# Altium schematic sheet sb-sonata-led.SchDoc: LEDs and Switches
size Letter; Organization: NewAE Technology Inc.; Address1: 1083 Queen St., Suite 196; Address2: Halifax; Address3: NS; Address4: Canada B3H 0B2; SheetNumber: 8; SheetTotal: 22; SheetApproved: YES
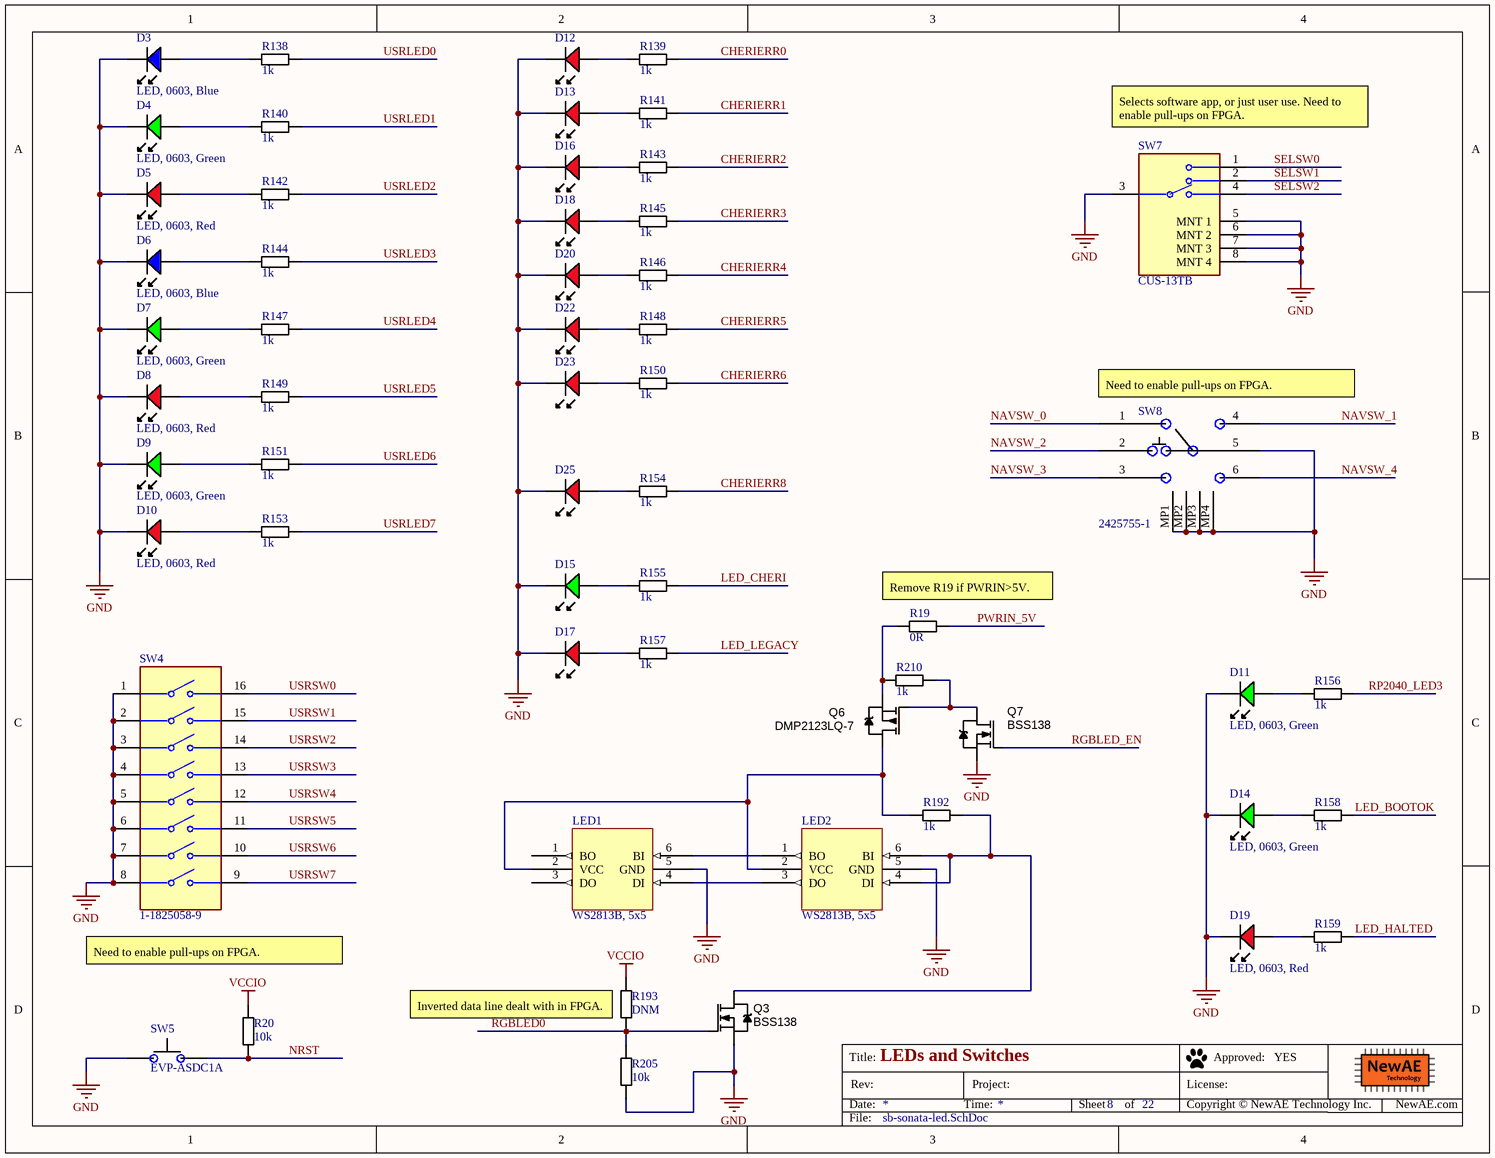
[diagram p0: sb-sonata-led.SchDoc]

## Parts
D3  LED, 0603, Blue  [LED-0603-BLUE]
D4  LED, 0603, Green  [LED-0603-GREEN]
D5  LED, 0603, Red  [LED-0603-RED]
D6  LED, 0603, Blue  [LED-0603-BLUE]
D7  LED, 0603, Green  [LED-0603-GREEN]
D8  LED, 0603, Red  [LED-0603-RED]
D9  LED, 0603, Green  [LED-0603-GREEN]
D10  LED, 0603, Red  [LED-0603-RED]
D11  LED, 0603, Green  [LED-0603-GREEN]
D12  LED, 0603, Red  [LED-0603-RED]  (value not drawn)
D13  LED, 0603, Red  [LED-0603-RED]  (value not drawn)
D14  LED, 0603, Green  [LED-0603-GREEN]
D15  LED, 0603, Green  [LED-0603-GREEN]  (value not drawn)
D16  LED, 0603, Red  [LED-0603-RED]  (value not drawn)
D17  LED, 0603, Red  [LED-0603-RED]  (value not drawn)
D18  LED, 0603, Red  [LED-0603-RED]  (value not drawn)
D19  LED, 0603, Red  [LED-0603-RED]
D20  LED, 0603, Red  [LED-0603-RED]  (value not drawn)
D22  LED, 0603, Red  [LED-0603-RED]  (value not drawn)
D23  LED, 0603, Red  [LED-0603-RED]  (value not drawn)
D25  LED, 0603, Red  [LED-0603-RED]  (value not drawn)
LED1  WS2813B, 5x5  [WS2813B_5x5]
LED2  WS2813B, 5x5  [WS2813B_5x5]
Q3  BSS138  [SOT95P245X110-3M]
Q6  DMP2123LQ-7  [SOT95P245X110-3M]
Q7  BSS138  [SOT95P245X110-3M]
R19  0R  [RESC1608X55N]
R20  10k  [RESC1005X40N]
R138  1k  [RESC1005X40N]
R139  1k  [RESC1005X40N]
R140  1k  [RESC1005X40N]
R141  1k  [RESC1005X40N]
R142  1k  [RESC1005X40N]
R143  1k  [RESC1005X40N]
R144  1k  [RESC1005X40N]
R145  1k  [RESC1005X40N]
R146  1k  [RESC1005X40N]
R147  1k  [RESC1005X40N]
R148  1k  [RESC1005X40N]
R149  1k  [RESC1005X40N]
R150  1k  [RESC1005X40N]
R151  1k  [RESC1005X40N]
R153  1k  [RESC1005X40N]
R154  1k  [RESC1005X40N]
R155  1k  [RESC1005X40N]
R156  1k  [RESC1005X40N]
R157  1k  [RESC1005X40N]
R158  1k  [RESC1005X40N]
R159  1k  [RESC1005X40N]
R192  1k  [RESC1005X40N]
R193  DNM  [RESC1005X40N]
R205  10k  [RESC1005X40N]
R210  1k  [RESC1005X40N]
SW4  1-1825058-9  [FP-1-1825058-9-MFG]
SW5  EVP-ASDC1A  [EVPAS]
SW7  CUS-13TB  [FP-CUS-13TB-MFG]
SW8  2425755-1  [2425755-1]

## Nets
GND: D3.K D4.K D5.K D6.K D7.K D8.K D9.K D10.K D11.K D12.K D13.K D14.K D15.K D16.K D17.K D18.K D19.K D20.K D22.K D23.K D25.K LED1.5(GND) LED2.5(GND) Q3.2(S) Q7.2(S) R205.2 SW4.1 SW4.2 SW4.3 SW4.4 SW4.5 SW4.6 SW4.7 SW4.8 SW5.1(IN) SW7.3(C) SW7.5(MNT_1) SW7.6(MNT_2) SW7.7(MNT_3) SW7.8(MNT_4) SW8.5 SW8.MP1 SW8.MP2 SW8.MP3 SW8.MP4
VCCIO: R20.1 R193.1
CHERIERR0: R139.1
CHERIERR1: R141.1
CHERIERR2: R143.1
CHERIERR3: R145.1
CHERIERR4: R146.1
CHERIERR5: R148.1
CHERIERR6: R150.1
CHERIERR8: R154.1
LED_BOOTOK: R158.1
LED_CHERI: R155.1
LED_HALTED: R159.1
LED_LEGACY: R157.1
NAVSW_0: SW8.1
NAVSW_1: SW8.4
NAVSW_2: SW8.2
NAVSW_3: SW8.3
NAVSW_4: SW8.6
NRST: R20.2 SW5.2(IN)
PWRIN_5V: R19.2
RGBLED0: Q3.1(G) R193.2 R205.1
RGBLED_EN: Q7.1(G)
RP2040_LED3: R156.1
SELSW0: SW7.1
SELSW1: SW7.2
SELSW2: SW7.4
USRLED0: R138.1
USRLED1: R140.1
USRLED2: R142.1
USRLED3: R144.1
USRLED4: R147.1
USRLED5: R149.1
USRLED6: R151.1
USRLED7: R153.1
USRSW0: SW4.16
USRSW1: SW4.15
USRSW2: SW4.14
USRSW3: SW4.13
USRSW4: SW4.12
USRSW5: SW4.11
USRSW6: SW4.10
USRSW7: SW4.9
NetD3_A: D3.A R138.2
NetD4_A: D4.A R140.2
NetD5_A: D5.A R142.2
NetD6_A: D6.A R144.2
NetD7_A: D7.A R147.2
NetD8_A: D8.A R149.2
NetD9_A: D9.A R151.2
NetD10_A: D10.A R153.2
NetD11_A: D11.A R156.2
NetD12_A: D12.A R139.2
NetD13_A: D13.A R141.2
NetD14_A: D14.A R158.2
NetD15_A: D15.A R155.2
NetD16_A: D16.A R143.2
NetD17_A: D17.A R157.2
NetD18_A: D18.A R145.2
NetD19_A: D19.A R159.2
NetD20_A: D20.A R146.2
NetD22_A: D22.A R148.2
NetD23_A: D23.A R150.2
NetD25_A: D25.A R154.2
NetLED1_2: LED1.2(VCC) LED2.2(VCC) Q6.3(D) R192.1
NetLED1_4: LED1.4(DI) LED2.3(DO)
NetLED1_6: LED1.6(BI) LED2.1(BO)
NetLED2_4: LED2.4(DI) LED2.6(BI) Q3.3(D) R192.2
NetQ6_1: Q6.1(G) Q7.3(D) R210.1
NetQ6_2: Q6.2(S) R19.1 R210.2

Not connected (* = marked no-connect by the designer): LED1 1(BO) 3(DO)

## Notes on the sheet
- (near SW7) Selects software app, or just user use. Need to enable pull-ups on FPGA.
- (near SW8) Need to enable pull-ups on FPGA.
- (near R19) Remove R19 if PWRIN>5V.
- Need to enable pull-ups on FPGA.
- (near R193) Inverted data line dealt with in FPGA.
- Title:
- Date:
- Rev:
- Time:
- Project:
- Sheet
- of
- License:
- Copyright © NewAE Technology Inc.
- Approved:
- NewAE.com
- File:

## Library data of the parts
D3 D6 = LEDCHIP_0603_BLUE: Chip LED, Blue; Manufacture 1: Kingbright; Manufacture Part Number 1: APT1608QBC/D; Component Group: Optical; Part Number: LEDCHIP_0603_BLUE; Pin Count: 2; Supplier 1: Digi-Key; Supplier Part Number 1: 754-1434-1-ND; Mounting Technology: SMT; Component Kind: Standard; Component Type: Standard
D4 D7 D9 D11 D14 D15 = LEDCHIP_0603_GREEN: Chip LED, Green; Manufacture 1: Kingbright; Manufacture Part Number 1: APT1608CGCK; Component Group: Optical; PP Material Stack: 16; PP Rotation: -90; Part Number: LEDCHIP_0603_GREEN; Pin Count: 2; Supplier 1: Digi-Key; Supplier Part Number 1: 754-1116-1-ND; Mounting Technology: SMT; Component Kind: Standard; Component Type: Standard
D5 D8 D10 D12 D13 D16-D20 D22 D23 D25 = LEDCHIP_0603_RED: Chip LED, Red; Manufacture 1: Kingbright; Manufacture Part Number 1: APT1608SURCK; Component Group: Optical; PP Material Stack: 15; PP Rotation: -90; Part Number: LEDCHIP_0603_RED; Pin Count: 2; Supplier 1: Digi-Key; Supplier Part Number 1: 754-1123-1-ND; Mounting Technology: SMT; Component Kind: Standard; Component Type: Standard
LED1 LED2 = WS2813B_5x5: WS2813B, 5x5 SMD Neopixel; Manufacture 1: Seeed Studio; Manufacture Part Number 1: 601000200; Component Group: Optical; PP Material Stack: 0; Part Number: WS2813B_5x5; Footprint: 5x5mm SMD; Pin Count: 6; Component Kind: Standard; Component Type: Standard; PP Rotation: 0; PP Rotation1: 0
Q3 Q7 = DMN3200U-7: MOSFET N-CH 30V 2.2A SOT23-3; Rated Power: 0.22A; PP Material Stack: 0; Part Number: BSS138; Component Group: MOSFET; Footprint: SOT23; Manufacture Part Number 1: BSS138; Pin Count: 3; Supplier 1: Digi-Key; Rated Voltage: 30V; Mounting Technology: SMT; RoHS: Yes; Component Kind: Standard; Component Type: Standard; PP Rotation: 0
Q6 = DMP2123LQ-7: P-Channel, 3A, Logic Level; Manufacture 1: Diodes Inc.; Component Group: MOSFET; Part Number: DMP2123LQ-7; Footprint: SOT23; Manufacture Part Number 1: DMP2123LQ-7; Pin Count: 3; Supplier 1: Digi-Key; Supplier Part Number 1: DMP2123LQ-7DICT-ND; Mounting Technology: SMT; Component Kind: Standard; Component Type: Standard
R19 = RCHIP-0R-0603: 0R, 0603, 1/10W; Manufacture 1: Yageo; Manufacture Part Number 1: RC0603FR-070RL; Component Group: Resistor; Case-EIA: 0603; Case-Metric: 1608; Rated Power: 0.1W; Rated Voltage: 75VDC; Tolerance: 1%; Part Number: RCHIP-0R-0603; Footprint: 0603; Pin Count: 2; Supplier 1: Digi-Key; Supplier Part Number 1: 311-0.0HRCT-ND; Value: 0R; Mounting Technology: SMT; Temperature Range: -55C to 155C; Component Kind: Standard; Component Type: Standard
R20 R205 = RCHIP-10K-0402: 10k res, 0402, 1%, 1/16W; Manufacture 1: Yageo; Manufacture Part Number 1: RC0402FR-0710KL; Component Group: Resistor; Case-EIA: 0402; Case-Metric: 1005; Rated Power: 0.063W; Rated Voltage: 75VDC; Part Number: RCHIP-10K-0402; Footprint: 0402; Pin Count: 2; Supplier 1: Digi-Key; Supplier Part Number 1: 311-10.0KLRCT-ND; Value: 10k; Tolerance: 1%; Mounting Technology: SMT; Temperature Range: -55C to 155C; Component Kind: Standard; Component Type: Standard
R138-R151 R153-R159 R192 R210 = RCHIP-1K-0402: 1k res, 0402, 1%, 1/16W; Manufacture 1: Yageo; Manufacture Part Number 1: RC0402FR-071KL; Component Group: Resistor; Case-EIA: 0402; Case-Metric: 1005; Rated Power: 0.063W; Rated Voltage: 75VDC; Part Number: RCHIP-1K-0402; Footprint: 0402; Pin Count: 2; Supplier 1: Digi-Key; Supplier Part Number 1: 311-1.00KLRCT-ND; Value: 1k; Tolerance: 1%; Mounting Technology: SMT; Temperature Range: -55C to 155C; Component Kind: Standard; Component Type: Standard
R193 = RCHIP-DNM-0402: Component Group: Resistor; Case-EIA: 0402; Case-Metric: 1005; Part Number: RCHIP-DNM-0402; Footprint: 0402; Pin Count: 2; Value: DNM; Component Kind: Standard; Component Type: Standard
SW4 = CMP-03400-000015-1: SWITCH SLIDE DIP SPST 100MA 24V; Manufacturer: TE Connectivity; Current Rating: 1A; Electromechanical Life: 1000Cycles; Contact Resistance: 50mΩ; Number Of Circuits: 8; Device Class L1: Electromechanical; Manufacturer Part Number: 1-1825058-9; Height: 5.1mm; ComponentLink2Description: Datasheet; Temperature Range High: +85°C; Digikey Description: SWITCH SLIDE DIP SPST 100MA 24V; Voltage Rating Dc: 24V; Package: 0; Automotive: No; ComponentLink2URL: https://www.te.com/commerce/DocumentDelivery/DDEController?Action=showdoc&DocId=Customer+Drawing%7F1825058%7FS5%7Fpdf%7FEnglish%7FENG_CD_1825058_S5.pdf%7F1-1825058-9; Octopart: https://octopart.com/1-1825058-9-te+connectivity-46507285; Temperature Range Low: -30°C; Device Class L2: Switches; Contact Current Rating: 100mA; Mount: Surface Mount; Temperature: -30°C to +85°C; Category: Switch; Device Class L3: DIP Switches; Lead Free: Yes; Throw Configuration: SPST; RoHS: TRUE
SW5 = EVP-ASDC1A: Pushbutton, SMD, 2.5NM force, NO; Manufacture 1: Panasonic; Component Group: Switch; Part Number: EVP-ASDC1A; Manufacture Part Number 1: EVP-ASDC1A; Pin Count: 2; Supplier 1: Digi-Key; Supplier Part Number 1: P16856CT-ND; Mounting Technology: SMT; Component Kind: Standard; Component Type: Standard
SW7 = CMP-71745-000014-1: SWITCH SLIDE SP3T 300MA 4V; Actuator Length: 1.5mm; Electrical Life: 10000Cycles; Max Voltage Rating (DC): 20V; Switch Function: On-On-On; Actuator Material: Nylon; Actuator Type: Standard; Contact Style: Non-Shorting; Contact Plating: Gold; Termination: Gull Wing; Radiation Hardening: No; Series: CUS; Max Operating Temperature: 70°C; Mount: Surface Mount; Switch Travel: 1.5mm; Packaging: Tape and Reel; Min Operating Temperature: -20°C; Contact Material: Copper Alloy; Orientation: Right Angle; Voltage Rating (DC): 4V; RoHS Compliant: Yes; Current Rating: 300mA; Throw Configuration: SP3T
SW8 = 2425755-1: 5-Way Joystick; Manufacture 1: TE; Component Group: Switch; PP Material Stack: 0; Part Number: 2425755-1; Manufacture Part Number 1: 2425755-1; Pin Count: 10; Supplier 1: Digi-Key; Component Kind: Standard; Component Type: Standard; PP Rotation: 0; PP Rotation1: 0